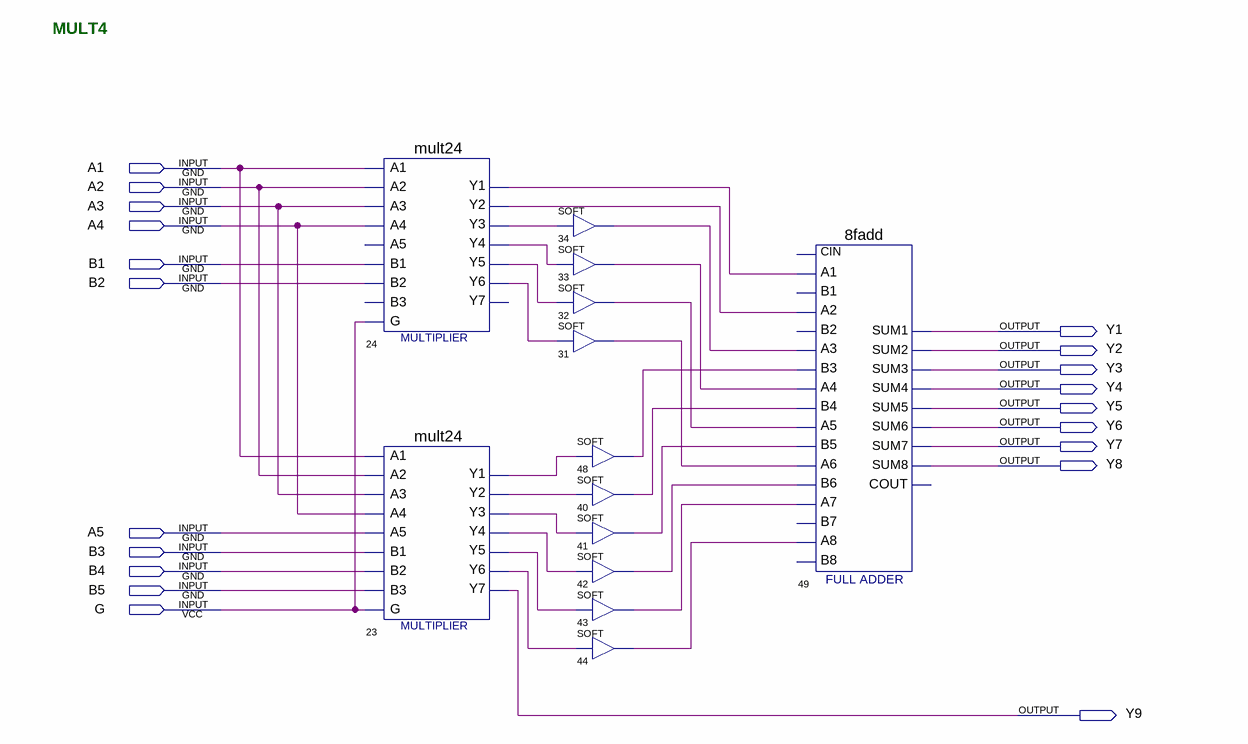
[diagram p0: schematic sheet]
// Quartus schematic mult4.bdf as structural Verilog: 13 symbols, 20 pins
module mult4 (
  input  A1,
  input  A2,
  input  A3,
  input  A4,
  input  B1,
  input  B2,
  input  A5,
  input  B3,
  input  B4,
  input  B5,
  input  G,
  output Y1,
  output Y2,
  output Y3,
  output Y4,
  output Y5,
  output Y6,
  output Y7,
  output Y8,
  output Y9
);

  wire n23_y1, n23_y2, n23_y3, n23_y4, n23_y5, n23_y6, n24_y1, n24_y2, n24_y3, n24_y4, n24_y5, n24_y6,
       n31_out, n32_out, n33_out, n34_out, n40_out, n41_out, n42_out, n43_out, n44_out, n48_out;

  mult24 u_24 (
    .A1(A1), .A2(A2), .A3(A3), .A4(A4), .B1(B1), .B2(B2), .G(G), .Y6(n24_y6), .Y5(n24_y5), .Y4(n24_y4),
    .Y3(n24_y3), .Y2(n24_y2), .Y1(n24_y1));  // open: A5, B3, Y7
  mult24 u_23 (
    .A1(A1), .A2(A2), .A3(A3), .A4(A4), .A5(A5), .B1(B3), .B2(B4), .B3(B5), .G(G), .Y7(Y9), .Y6(n23_y6),
    .Y5(n23_y5), .Y4(n23_y4), .Y3(n23_y3), .Y2(n23_y2), .Y1(n23_y1));
  SOFT u_34 (.IN(n24_y3), .OUT(n34_out));
  SOFT u_33 (.IN(n24_y4), .OUT(n33_out));
  SOFT u_32 (.IN(n24_y5), .OUT(n32_out));
  SOFT u_31 (.IN(n24_y6), .OUT(n31_out));
  SOFT u_48 (.IN(n23_y1), .OUT(n48_out));
  SOFT u_40 (.IN(n23_y2), .OUT(n40_out));
  SOFT u_41 (.IN(n23_y3), .OUT(n41_out));
  SOFT u_42 (.IN(n23_y4), .OUT(n42_out));
  SOFT u_43 (.IN(n23_y5), .OUT(n43_out));
  SOFT u_44 (.IN(n23_y6), .OUT(n44_out));
  \8fadd  u_49 (
    .A1(n24_y1), .A3(n34_out), .A2(n24_y2), .A5(n32_out), .B4(n40_out), .A4(n33_out), .B3(n48_out),
    .A7(n43_out), .B6(n42_out), .A6(n31_out), .B5(n41_out), .A8(n44_out), .SUM2(Y2), .SUM1(Y1), .SUM6(Y6),
    .SUM5(Y5), .SUM4(Y4), .SUM3(Y3), .SUM8(Y8), .SUM7(Y7));  // open: CIN, B2, B1, B8, B7, COUT

  // Notes on the sheet:
  //   MULT4
endmodule
